# Altium schematic sheet 01_MAIN.SchDoc: =GlobalProjectName
size 594 x 420 mm; CheckedBy: A_D; Author: A_D; SheetNumber: 1; SheetTotal: 3; PageSetup: Record=PageOptions|CenterHorizontal=True|CenterVertical=True|PrintScale=0.70|XCorrection=1.00|YCorrection=1.00|PrintKind=2|BorderSize=5000000|LeftOffset=9000|BottomOffset=10100|Orientation=2|PaperLength=11176|PaperWidth=8636|Scale=100|PaperSource=259|PrintQuality=-3|MediaType=1|DitherType=10|PrintScaleMode=1|PaperKind=A3|PaperIndex=8
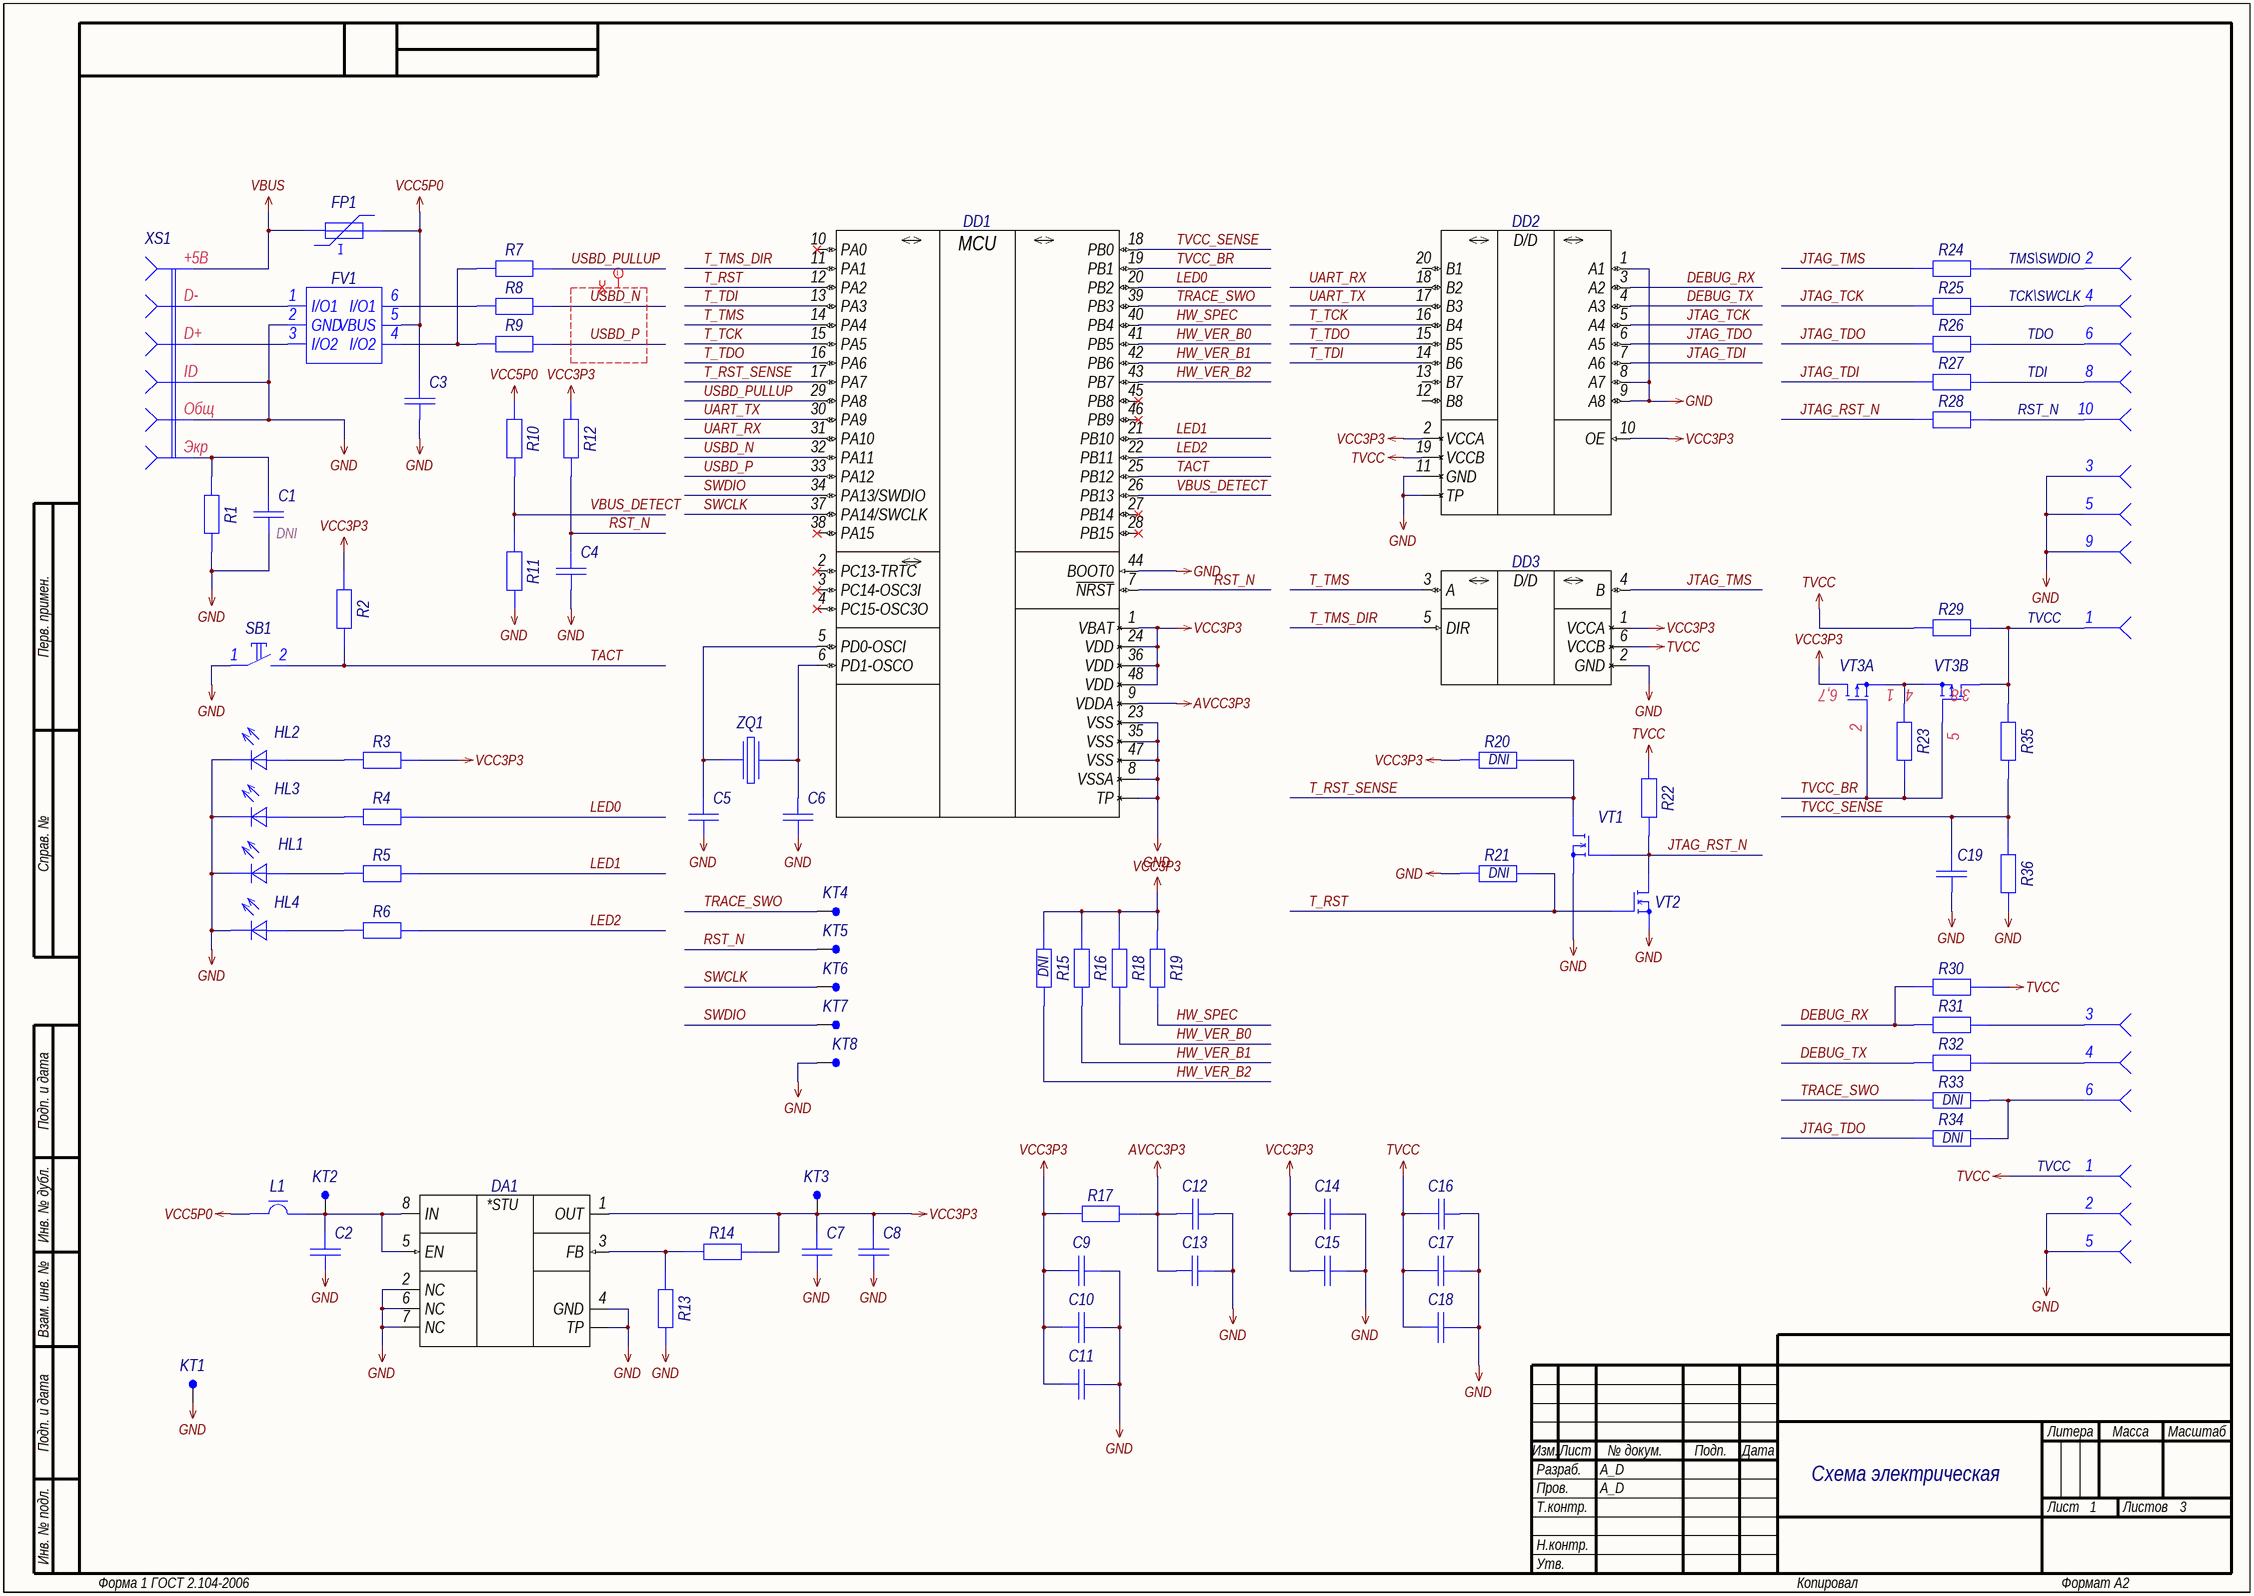
[diagram p0: 01_MAIN.SchDoc]

## Parts
C1  Capacitor  [C0603_L]  (value not drawn)  (no BOM)
C2  Capacitor  [C0402_L]  (value not drawn)
C3  Capacitor  [C0603_L]  (value not drawn)
C4  Capacitor  [C0402_L]  (value not drawn)
C5  Capacitor  [C0402_L]  (value not drawn)
C6  Capacitor  [C0402_L]  (value not drawn)
C7  Capacitor  [C0402_L]  (value not drawn)
C8  Capacitor  [C0402_L]  (value not drawn)
C9  Capacitor  [C0402_L]  (value not drawn)
C10  Capacitor  [C0402_L]  (value not drawn)
C11  Capacitor  [C0402_L]  (value not drawn)
C12  Capacitor  [C0402_L]  (value not drawn)
C13  Capacitor  [C0402_L]  (value not drawn)
C14  Capacitor  [C0402_L]  (value not drawn)
C15  Capacitor  [C0402_L]  (value not drawn)
C16  Capacitor  [C0402_L]  (value not drawn)
C17  Capacitor  [C0402_L]  (value not drawn)
C18  Capacitor  [C0402_L]  (value not drawn)
C19  Capacitor  [C0402_L]  (value not drawn)
DA1  TPS73701DRB  [VSON-8_065P300X300X100_N]  (value not drawn)
DD1  STM32F103CxUx-Series  [UFQFPN-48_050P700X700X060_N]  (value not drawn)
DD2  TXS0108ERGY  [VQFN-20_050P450X350X100_N]  (value not drawn)
DD3  74LVC1T45x-Series  [X2-DFN-6_050P140X100X040_N]  (value not drawn)
FP1  Fuse_PTC  [F0603_L]  (value not drawn)
FV1  USBLC6-2x6  [SOT-666_050P160X120X060_N]  (value not drawn)
HL1  (no value)  [LD0402_L]
HL2  Text  [LD0402_L]  (value not drawn)
HL3  Text  [LD0402_L]  (value not drawn)
HL4  (no value)  [LD0402_L]
KT1  Text  [TP-SMT-R-0.8mm]  (value not drawn)  (no BOM)
KT2  Text  [TP-SMT-C-0.5mm]  (value not drawn)  (no BOM)
KT3  Text  [TP-SMT-C-0.5mm]  (value not drawn)  (no BOM)
KT4  SWO  [TP-SMT-C-0.5mm]  (value not drawn)  (no BOM)
KT5  SWO  [TP-SMT-C-0.5mm]  (value not drawn)  (no BOM)
KT6  SWO  [TP-SMT-C-0.5mm]  (value not drawn)  (no BOM)
KT7  SWO  [TP-SMT-C-0.5mm]  (value not drawn)  (no BOM)
KT8  Text  [TP-SMT-R-0.8mm]  (value not drawn)  (no BOM)
L1  FerriteBead  [L0603_L]  (value not drawn)
R1  Resistor  [R0603_L]  (value not drawn)
R2  Resistor  [R0402_L]  (value not drawn)
R3  Resistor  [R0402_L]  (value not drawn)
R4  Resistor  [R0402_L]  (value not drawn)
R5  Resistor  [R0402_L]  (value not drawn)
R6  Resistor  [R0402_L]  (value not drawn)
R7  Resistor  [R0402_L]  (value not drawn)
R8  Resistor  [R0402_L]  (value not drawn)
R9  Resistor  [R0402_L]  (value not drawn)
R10  Resistor  [R0402_L]  (value not drawn)
R11  Resistor  [R0402_L]  (value not drawn)
R12  Resistor  [R0402_L]  (value not drawn)
R13  Resistor  [R0402_L]  (value not drawn)
R14  Resistor  [R0402_L]  (value not drawn)
R15  Resistor  [R0402_L]  (value not drawn)  (no BOM)
R16  Resistor  [R0402_L]  (value not drawn)
R17  Resistor  [R0402_L]  (value not drawn)
R18  Resistor  [R0402_L]  (value not drawn)
R19  Resistor  [R0402_L]  (value not drawn)
R20  Resistor  [R0402_L]  (value not drawn)  (no BOM)
R21  Resistor  [R0402_L]  (value not drawn)  (no BOM)
R22  Resistor  [R0402_L]  (value not drawn)
R23  Resistor  [R0402_L]  (value not drawn)
R24  Resistor  [R0402_L]  (value not drawn)
R25  Resistor  [R0402_L]  (value not drawn)
R26  Resistor  [R0402_L]  (value not drawn)
R27  Resistor  [R0402_L]  (value not drawn)
R28  Resistor  [R0402_L]  (value not drawn)
R29  Resistor  [R0402_L]  (value not drawn)
R30  Resistor  [R0402_L]  (value not drawn)
R31  Resistor  [R0402_L]  (value not drawn)
R32  Resistor  [R0402_L]  (value not drawn)
R33  Resistor  [R0402_L]  (value not drawn)  (no BOM)
R34  Resistor  [R0402_L]  (value not drawn)  (no BOM)
R35  Resistor  [R0402_L]  (value not drawn)
R36  Resistor  [R0402_L]  (value not drawn)
SB1  (no value)  [IT-1185AP]
VT1  MOSFET-N  [SOT-883B_035P060X100X040_N]  (value not drawn)
VT2  MOSFET-N  [SOT-883B_035P060X100X040_N]  (value not drawn)
VT3  MOSFET-PP_8p_2  [SOT-1118-2M_065P200X200X065_N]  (value not drawn)  (parts A,B of 2)
XS1  USB  [1981568-1]  (value not drawn)
XS2  JTAG  [XF2M-1015-1A]  (value not drawn)  (parts A,B,C,D,E,F,H,I,J of 10)
XS3  DEBUG  [XF2M-0615-1A]  (value not drawn)  (parts A,B,C,D,E,F of 6)
ZQ1  Crystal  [SMD 5x3.2mm]  (value not drawn)

## Nets
AVCC3P3: C12.1 C13.2 DD1.9(VDDA) R17.1
GND: C1.1 C2.1 C3.1 C4.1 C5.1 C6.1 C7.1 C8.1 C9.1 C10.1 C11.1 C12.2 C13.1 C14.1 C15.1 C16.2 C17.1 C18.1 C19.1 DA1.2(NC) DA1.4(GND) DA1.6(NC) DA1.7(NC) DA1.TP DD1.8(VSSA) DD1.23(VSS) DD1.35(VSS) DD1.44(BOOT0) DD1.47(VSS) DD1.TP DD2.1(A1) DD2.8(A7) DD2.9(A8) DD2.11(GND) DD2.TP DD3.2(GND) FV1.2(GND) HL1.2(К) HL2.2(К) HL3.2(К) HL4.2(К) KT1.1 KT8.1 R1.1 R11.1 R13.1 R21.2 R36.1 SB1.1 VT1.3(S) VT2.3(S) XS1.4 XS1.5 XS2.3 XS2.5 XS2.9 XS3.2 XS3.5
TVCC: C16.1 C17.2 C18.2 DD2.19(VCCB) DD3.6(VCCB) R22.2 R29.1 R30.1 XS3.1
VBUS: FP1.1 XS1.1
VCC3P3: C7.2 C8.2 C9.2 C10.2 C11.2 C14.2 C15.2 DA1.1(OUT) DD1.1(VBAT) DD1.24(VDD) DD1.36(VDD) DD1.48(VDD) DD2.2(VCCA) DD2.10(OE) DD3.1(VCCA) KT3.1 R2.2 R3.2 R12.2 R14.2 R15.2 R16.2 R17.2 R18.2 R19.2 R20.2 VT3.6(D1)
VCC5P0: C3.2 FP1.2 FV1.5(VBUS) L1.1 R10.2
DEBUG_RX: DD2.3(A2) R30.2 R31.1
DEBUG_TX: DD2.4(A3) R32.1
HW_SPEC: DD1.40(PB4) R19.1
HW_VER_B0: DD1.41(PB5) R18.1
HW_VER_B1: DD1.42(PB6) R16.1
HW_VER_B2: DD1.43(PB7) R15.1
JTAG_RST_N: R22.1 R28.1 VT1.1(G) VT2.2(D)
JTAG_TCK: DD2.5(A4) R25.1
JTAG_TDI: DD2.7(A6) R27.1
JTAG_TDO: DD2.6(A5) R26.1 R34.2
JTAG_TMS: DD3.4(B) R24.1
LED0: DD1.20(PB2) R4.2
LED1: DD1.21(PB10) R5.2
LED2: DD1.22(PB11) R6.2
RST_N: C4.2 DD1.7(~{NRST}) KT5.1 R12.1
SWCLK: DD1.37(PA14/SWCLK) KT6.1
SWDIO: DD1.34(PA13/SWDIO) KT7.1
T_RST: DD1.12(PA2) R21.1 VT2.1(G)
T_RST_SENSE: DD1.17(PA7) R20.1 VT1.2(D)
T_TCK: DD1.15(PA5) DD2.16(B4)
T_TDI: DD1.13(PA3) DD2.14(B6)
T_TDO: DD1.16(PA6) DD2.15(B5)
T_TMS: DD1.14(PA4) DD3.3(A)
T_TMS_DIR: DD1.11(PA1) DD3.5(DIR)
TACT: DD1.25(PB12) R2.1 SB1.2
TRACE_SWO: DD1.39(PB3) KT4.1 R33.2
TVCC_BR: DD1.19(PB1) R23.1 VT3.2(G1) VT3.5(G2)
TVCC_SENSE: C19.2 DD1.18(PB0) R35.1 R36.2
UART_RX: DD1.31(PA10) DD2.18(B2)
UART_TX: DD1.30(PA9) DD2.17(B3)
USBD_N: DD1.32(PA11) R8.2
USBD_P: DD1.33(PA12) R9.2
USBD_PULLUP: DD1.29(PA8) R7.2
VBUS_DETECT: DD1.26(PB13) R10.1 R11.2
NetC1_2: C1.2 R1.2 XS1.6
NetC2_2: C2.2 DA1.5(EN) DA1.8(IN) KT2.1 L1.2
NetC5_2: C5.2 DD1.5(PD0-OSCI) ZQ1.3
NetC6_2: C6.2 DD1.6(PD1-OSCO) ZQ1.1
NetDA1_3: DA1.3(FB) R13.2 R14.1
NetFV1_1: FV1.1(I/O1) XS1.2
NetFV1_3: FV1.3(I/O2) XS1.3
NetFV1_4: FV1.4(I/O2) R7.1 R9.1
NetFV1_6: FV1.6(I/O1) R8.1
NetHL1_1: HL1.1(А) R5.1
NetHL2_1: HL2.1(А) R3.1
NetHL3_1: HL3.1(А) R4.1
NetHL4_1: HL4.1(А) R6.1
NetR23_2: R23.2 VT3.1(S1) VT3.4(S2)
NetR24_2: R24.2 XS2.2
NetR25_2: R25.2 XS2.4
NetR26_2: R26.2 XS2.6
NetR27_2: R27.2 XS2.8
NetR28_2: R28.2 XS2.10
NetR29_2: R29.2 R35.2 VT3.3(D2) XS2.1
NetR31_2: R31.2 XS3.3
NetR32_2: R32.2 XS3.4
NetR33_1: R33.1 R34.1 XS3.6

Not connected (* = marked no-connect by the designer): DD1 2(PC13-TRTC)* 3(PC14-OSC3I)* 4(PC15-OSC3O)* 10(PA0)* 27(PB14)* 28(PB15)* 38(PA15)* 45(PB8)* 46(PB9)*; DD2 12(B8) 13(B7) 20(B1)

## Layout directives
rule Matched Net Lengths [Tolerance = 1mm]: USBD_N, USBD_P
differential pair; differential pair class USB: USBD_N, USBD_P

## Notes on the sheet
- TMS\SWDIO
- (near XS2) TCK\SWCLK
- TDO
- TDI
- RST_N
- (near C1) DNI
- TVCC
- (near R20) DNI
- (near R21) DNI
- (near R15) DNI
- (near R33) DNI
- (near R34) DNI
- (near XS3) TVCC
- Схема электрическая
  принципиальная
- Перв. примен.
- Справ. №
- Подп. и дата
- Инв. № дубл.
- Взам. инв. №
- Разраб.
- Изм.
- Лист
- № докум.
- Подп.
- Дата
- Литера
- Масса
- Масштаб
- Пров.
- Т.контр.
- Листов
- Инв. № подл.
- Н.контр.
- Утв.
- Форма 1 ГОСТ 2.104-2006
- Копировал
- Формат А2
- (in symbol 74LVC1T45FZ4-7) D/D
- (in symbol 1981568-1) +5В; D-; D+; ID; Общ; Экр
- (in symbol PMDPB70XP, part A) 6,7
- (in symbol PMDPB70XP, part B) 3,8
- (in symbol STM32F103CBU6) MCU
- (in symbol TPS73701DRBR) *STU
- (in symbol TXS0108ERGYR) D/D

## Library data of the parts
C1 = GRM188R72A104KA35D: Manufacturer: Murata; Type: Конденсатор; ID: 232; Value: 0.1uF; Voltage: 100V; Tolerance: ±10%; Dielectric Type: X7R; Application Category: 1; Working Temperature Min: -55°С; Working Temperature Max: +125°С; Published: 18.05.2010; Publisher: Andrew Danich; Part Number: GRM188R72A104KA35D; Footprint: 0603; ClassName: DirectConnect
C2 C7 C8 = GRM155R60J475ME87D: Manufacturer: Murata; Type: Конденсатор; ID: 223; Value: 4.7uF; Voltage: 6.3V; Tolerance: ±20%; Dielectric Type: X5R; Application Category: 1; Working Temperature Min: -55°С; Working Temperature Max: +85°С; Published: 18.05.2010; Publisher: Andrew Danich; Part Number: GRM155R60J475ME87D; Footprint: 0402; ClassName: DirectConnect
C3 = GRM188R60J106ME47D: Manufacturer: Murata; Type: Конденсатор; ID: 136; Value: 10uF; Voltage: 6.3V; Tolerance: ±20%; Dielectric Type: X5R; Application Category: 1; Working Temperature Min: -55°С; Working Temperature Max: +85°С; Published: 18.05.2010; Publisher: Andrew Danich; Part Number: GRM188R60J106ME47D; Footprint: 0603; ClassName: DirectConnect
C4 C9-C11 C13-C15 C17-C19 = GCM155R71C104KA55D: Manufacturer: Murata; Type: Конденсатор; ID: 163; Value: 0.1uF; Voltage: 16V; Tolerance: ±10%; Dielectric Type: X7R; Application Category: 1; Working Temperature Min: -55°С; Working Temperature Max: +125°С; Functional Analog: GRM155R71C104KA88D; Published: 18.05.2010; Publisher: Andrew Danich; Part Number: GCM155R71C104KA55D; Footprint: 0402
C5 C6 = GRM1555C1H150JA01D: Manufacturer: Murata; Type: Конденсатор; ID: 193; Value: 15pF; Voltage: 50V; Tolerance: ±5%; Dielectric Type: NP0; Application Category: 1; Working Temperature Min: -55°С; Working Temperature Max: +125°С; Published: 18.05.2010; Publisher: Andrew Danich; Part Number: GRM1555C1H150JA01D; Footprint: 0402
C12 C16 = GRM155C71A105KE11D: Manufacturer: Murata; Type: Конденсатор; ID: 179; Value: 1uF; Voltage: 10V; Tolerance: ±10%; Dielectric Type: X7S; Application Category: 1; Working Temperature Min: -55°С; Working Temperature Max: +125°С; Published: 18.05.2010; Publisher: Andrew Danich; Part Number: GRM155C71A105KE11D; Footprint: 0402
DA1 = TPS73701DRBR: Manufacturer: Texas Instruments; ID: 26; Input Voltage: +2.2…5.5V; Output Current: 1A; Output Voltage: +1.2…5.5V; Application Category: 1; Working Temperature Min: -40°С; Working Temperature Max: +125°С; Functional Analog: TPS73701DRBT; Published: 25.03.2019; Publisher: Andrew Danich; Type: Микросхема; Part Number: TPS73701DRBR; Value: TPS73701DRBR; ClassName: DirectConnect
DD1 = STM32F103CBU6: Manufacturer: STMicroelectronics; ID: 30; Supply Operation: +2.0…3.6V; Flash: 128K; SRAM: 20K; Prog Interface: JTAG, SWD, UART; I/O Lines: 37; Operation Frequency: 72MHz; Application Category: 1; Working Temperature Min: -40°С; Working Temperature Max: +85°С; Published: 17.05.2019; Publisher: Andrew Danich; Type: Микросхема; Part Number: STM32F103CBU6; Value: STM32F103CBU6; EEPROM: -
DD2 = TXS0108ERGYR: Manufacturer: Texas Instruments; ID: 14; Supply 1 Operation: +1.2…3.6V; Supply 2 Operation: +1.65…5.5V; Supply Current: 6uA; Directional: Bidirection; Channels: 8; Prop Delay: 11.1nS; Max Data Rate: 110Mbps; Application Category: 1; Working Temperature Min: -40°С; Working Temperature Max: +85°С; Published: 08.01.2019; Publisher: Andrew Danich; Type: Микросхема; Part Number: TXS0108ERGYR; Value: TXS0108ERGYR
DD3 = 74LVC1T45FZ4-7: Manufacturer: Diodes Incorporated; ID: 13; Supply 1 Operation: +1.65…5.5V; Supply Current: 3uA; Directional: Bidirection; Channels: 1; Prop Delay: 15.1nS; Working Temperature Min: -40°С; Working Temperature Max: +150°С; Published: 17.07.2019; Publisher: Andrew Danich; Type: Микросхема; Part Number: 74LVC1T45FZ4-7; Value: 74LVC1T45FZ4-7; Supply 2 Operation: +1.65…5.5V; Application Category: 1
FP1 = 0603L100SLYR: Manufacturer: Littelfuse; ID: 13; Limit Voltage: 6V; Rated Current: 1A; Resistance: 0.12ohm; Application Category: 1; Working Temperature Min: -40°С; Working Temperature Max: +85°С; Published: 25.0.2017; Value: 0603L100SLYR; Type: Предохранитель самовосстанавливающийся; Part Number: 0603L100SLYR; Footprint: F0603; Functional Analog: -; ClassName: DirectConnect
FV1 = USBLC6-2P6: Manufacturer: STMicroelectronics; ID: 30; Breakdown Voltage: 6V; Reverse Stand Off Voltage: 17V; Forward Voltage: 0.95V; Peak Forward Current: 5A; Junction Capacitance: 2.5pF; Directional: Bidirectional; Application Category: 1; Working Temperature Min: -40°С; Working Temperature Max: +125°С; Published: 21.02.2017; Publisher: Andrew Danich; Type: Супрессор; Part Number: USBLC6-2P6; Value: USBLC6-2P6; Functional Analog: -
HL1 = KPHHS-1005SURCK: Manufacturer: Kingbright; Type: Индикатор единичный; ID: 35; Forward Voltage: 2.5V; Forward Current: 20mA; Power Dissipation: 75mW; Luminous Flux: 140; Color: Red; Leds: 1; Working Temperature Min: -40°С; Working Temperature Max: +85°С; Published: 03.12.2013; Publisher: Andrew Danich; Part Number: KPHHS-1005SURCK; Value: KPHHS-1005SURCK; Footprint: 0402; Application Category: 1
HL2 HL3 = KPHHS-1005CGCK: Manufacturer: Kingbright; Type: Индикатор единичный; ID: 25; Forward Voltage: 2.1V; Forward Current: 20mA; Power Dissipation: 75mW; Luminous Flux: 60; Color: Green; Leds: 1; Working Temperature Min: -40°С; Working Temperature Max: +85°С; Published: 03.12.2013; Publisher: Andrew Danich; Part Number: KPHHS-1005CGCK; Value: KPHHS-1005CGCK; Footprint: 0402; Application Category: 1
HL4 = KPHHS-1005QBC-D-V: Manufacturer: Kingbright; Type: Индикатор единичный; ID: 24; Forward Voltage: 3.3V; Forward Current: 20mA; Power Dissipation: 120mW; Luminous Flux: 60; Color: Blue; Leds: 1; Working Temperature Min: -40°С; Working Temperature Max: +85°С; Published: 03.12.2013; Publisher: Andrew Danich; Part Number: KPHHS-1005QBC-D-V; Value: KPHHS-1005QBC-D-V; Footprint: 0402; Application Category: 1
KT1 KT8 = TestPoint-SMT-GND: ID: 7; Application Type: On PCB Test Point; Application Category: 1; Published: 03.03.2015; Publisher: Andrew Danich; Part Number: TestPoint-SMT-GND; Value: TestPoint-SMT; Manufacturer: -; Functional Analog: -
KT2-KT7 = TestPoint-SMT: ID: 6; Application Type: On PCB Test Point; Application Category: 1; Published: 03.03.2015; Publisher: Andrew Danich; Part Number: TestPoint-SMT; Value: TestPoint-SMT; Manufacturer: -; Functional Analog: -
L1 = BLM18PG121SN1: Manufacturer: Murata; Type: Дроссель; ID: 4; Rated Current: 2A; Impedance at 100Mhz: 120ohm; Tolerance: ±25%; DC Resistance: 0.05ohm; Inductor Type: EMIFIL; Application Category: 1; Working Temperature Min: -55°С; Working Temperature Max: +125°С; Published: 14.11.2014; Publisher: Andrew Danich; Part Number: BLM18PG121SN1; Value: BLM18PG121SN1; Footprint: 0603; ClassName: DirectConnect
R1 = RC0603JR-070R: Manufacturer: Yageo; ID: 5; Value: 0; Limit Voltage: 50V; Tolerance: ±5%; Temperature Coefficient: 100ppm; Total Power Dissipation: 0.1W; Series Type: Thick-Film; Application Category: 1; Working Temperature Min: -55°С; Working Temperature Max: +155°С; Functional Analog: RC0603FR-070RL, CR0603-J/-000E; Published: 24.03.2010; Publisher: Andrew Danich; Type: Резистор; Part Number: RC0603JR-070R; Footprint: 0603; ClassName: DirectConnect
R2 R11 R12 R20-R23 R30 R36 = RC0402JR-0710KL: Manufacturer: Yageo; ID: 476; Value: 10k; Limit Voltage: 50V; Tolerance: ±5%; Temperature Coefficient: 100ppm; Total Power Dissipation: 0.1W; Series Type: Thick-Film; Application Category: 1; Working Temperature Min: -55°С; Working Temperature Max: +155°С; Published: 24.03.2010; Publisher: Andrew Danich; Type: Резистор; Part Number: RC0402JR-0710KL; Footprint: 0402
R3-R6 = RC0402JR-071KL: Manufacturer: Yageo; ID: 3; Value: 1k; Limit Voltage: 50V; Tolerance: ±5%; Temperature Coefficient: 100ppm; Total Power Dissipation: 0.1W; Series Type: Thick-Film; Application Category: 1; Working Temperature Min: -55°С; Working Temperature Max: +155°С; Published: 24.03.2010; Publisher: Andrew Danich; Type: Резистор; Part Number: RC0402JR-071KL; Footprint: 0402
R7 = RC0402FR-071K6L: Manufacturer: Yageo; ID: 504; Value: 1.6k; Limit Voltage: 50V; Tolerance: ±1%; Temperature Coefficient: 100ppm; Total Power Dissipation: 0.1W; Series Type: Thick-Film; Application Category: 1; Working Temperature Min: -55°С; Working Temperature Max: +155°С; Published: 24.03.2010; Publisher: Andrew Danich; Type: Резистор; Part Number: RC0402FR-071K6L; Footprint: 0402
R8 R9 = RC0402JR-0720RL: Manufacturer: Yageo; ID: 369; Value: 20; Limit Voltage: 50V; Tolerance: ±5%; Temperature Coefficient: 100ppm; Total Power Dissipation: 0.1W; Series Type: Thick-Film; Application Category: 1; Working Temperature Min: -55°С; Working Temperature Max: +155°С; Published: 24.03.2010; Publisher: Andrew Danich; Type: Резистор; Part Number: RC0402JR-0720RL; Footprint: 0402
R10 R35 = RC0402JR-074K7L: Manufacturer: Yageo; ID: 4; Value: 4.7k; Limit Voltage: 50V; Tolerance: ±5%; Temperature Coefficient: 100ppm; Total Power Dissipation: 0.1W; Series Type: Thick-Film; Application Category: 1; Working Temperature Min: -55°С; Working Temperature Max: +155°С; Published: 24.03.2010; Publisher: Andrew Danich; Type: Резистор; Part Number: RC0402JR-074K7L; Footprint: 0402
R13 = RC0402FR-0712KL: Manufacturer: Yageo; ID: 318; Value: 12k; Limit Voltage: 50V; Tolerance: ±1%; Temperature Coefficient: 100ppm; Total Power Dissipation: 0.1W; Series Type: Thick-Film; Application Category: 1; Working Temperature Min: -55°С; Working Temperature Max: +155°С; Published: 24.03.2010; Publisher: Andrew Danich; Type: Резистор; Part Number: RC0402FR-0712KL; Footprint: 0402
R14 = RC0402FR-0722K1L: Manufacturer: Yageo; ID: 447; Value: 22.1k; Limit Voltage: 50V; Tolerance: ±1%; Temperature Coefficient: 100ppm; Total Power Dissipation: 0.1W; Series Type: Thick-Film; Application Category: 1; Working Temperature Min: -55°С; Working Temperature Max: +155°С; Published: 24.03.2010; Publisher: Andrew Danich; Type: Резистор; Part Number: RC0402FR-0722K1L; Footprint: 0402
R15-R19 R33 R34 = RC0402JR-070RL: Manufacturer: Yageo; ID: 362; Value: 0; Limit Voltage: 50V; Tolerance: ±5%; Temperature Coefficient: 100ppm; Total Power Dissipation: 0.1W; Series Type: Thick-Film; Application Category: 1; Working Temperature Min: -55°С; Working Temperature Max: +155°С; Published: 24.03.2010; Publisher: Andrew Danich; Type: Резистор; Part Number: RC0402JR-070RL; Footprint: 0402
R24-R29 R31 R32 = RC0402JR-07100RL: Manufacturer: Yageo; ID: 479; Value: 100; Limit Voltage: 50V; Tolerance: ±5%; Temperature Coefficient: 100ppm; Total Power Dissipation: 0.1W; Series Type: Thick-Film; Application Category: 1; Working Temperature Min: -55°С; Working Temperature Max: +155°С; Published: 24.03.2010; Publisher: Andrew Danich; Type: Резистор; Part Number: RC0402JR-07100RL; Footprint: 0402
SB1 = IT-1185AP: ID: 36; Limit Current: 50mA; Resistance: 0.1ohm; Isolator Resistance: 100meg; Backlight: NO; Number of Contacts: 2; Application Category: 1; Published: 17.04.2014; Publisher: Andrew Danich; Type: Переключатель; Part Number: IT-1185AP; Value: IT-1185AP; Height: 5mm
VT1 VT2 = NX3008NBKMB: Manufacturer: NXP Semiconductors; Type: Транзистор; ID: 36; D-S Voltage: 30V; Drain Current: 530mA; D-S On-Resistance: 1.4omh; Gate Capacitance: 50pF; Total Power Dissipation: 360mW; Gate Threshold Voltage: 1.1V; Application Category: 1; Working Temperature Min: -55°С; Working Temperature Max: +150°С; Published: 24.09.2010; Publisher: Andrew Danich; Part Number: NX3008NBKMB; Value: NX3008NBKMB; Functional Analog: -
VT3 = PMDPB70XP: Manufacturer: NXP Semiconductors; Type: Сборка транзисторная; ID: 43; D-S Voltage: -30V; Drain Current: -3.8A; D-S On-Resistance: 87momh; Gate Capacitance: 680pF; Total Power Dissipation: 490mW; Gate Threshold Voltage: -1V; Application Category: 1; Working Temperature Min: -55°С; Working Temperature Max: +150°С; Published: 18.07.2014; Publisher: Andrew Danich; Part Number: PMDPB70XP; Value: PMDPB70XP; Functional Analog: -
XS1 = 1981568-1: Manufacturer: TE Connectivity; ID: 30; Limit Voltage: 24V; Limit Current: 1A; Connector Type: Female; Interface: USB 2.0; Max Data Rate: 480 mbps; Application Category: 1; Published: 11.04.2016; Publisher: Andrew Danich; Type: Розетка; Part Number: 1981568-1; Value: 1981568-1; Pins: 9; Mount Type: Surface; ClassName: DirectConnect
XS2 = XF2M-1015-1A: Manufacturer: Omron Electronics; ID: 7; Limit Voltage: 50V; Limit Current: 500mA; Connector Type: Female; Resistance: 0.05ohm; Pitch: 0.5mm; Application Category: 1; Working Temperature Min: -30°С; Working Temperature Max: +85°С; Published: 07.09.2015; Publisher: Viktor Klishin; Type: Розетка; Part Number: XF2M-1015-1A; Value: XF2M-1015-1A; Pins: 10; Series: FPC; ClassName: DirectConnect
XS3 = XF2M-0615-1A: Manufacturer: Omron Electronics; ID: 6; Limit Voltage: 50V; Limit Current: 500mA; Connector Type: Female; Resistance: 0.05ohm; Pitch: 0.5mm; Application Category: 1; Working Temperature Min: -30°С; Working Temperature Max: +85°С; Published: 16.02.2017; Publisher: Viktor Klishin; Type: Розетка; Part Number: XF2M-0615-1A; Value: XF2M-0615-1A; Pins: 6; Series: FPC; ClassName: DirectConnect
ZQ1 = KX-9A 8.0 MHz 30/50/100 16 pF: Manufacturer: Geyer; ID: 12; Output Frequency: 8MHz; Shunt Capacitance: 5pF; Load Capacitance: 16pF; Temperature Coefficient: ±50ppm; Application Category: 1; Working Temperature Min: -20°С; Working Temperature Max: +70°С; Published: 08.03.2013; Publisher: Andrew Danich; Type: Резонатор; Part Number: KX-9A 8.0 MHz 30/50/100 16 pF; Value: KX-9A 8.0 MHz 30/50/100 16 pF; Functional Analog: -